# Altium schematic sheet MarsCarrier.SchDoc: My title
size A3; Organization: University of California; Address1: 475 Portola Plaza; Address2: Los Angeles, CA 90095; DocumentNumber: 19; Revision: R01; SheetNumber: 19; SheetTotal: 35
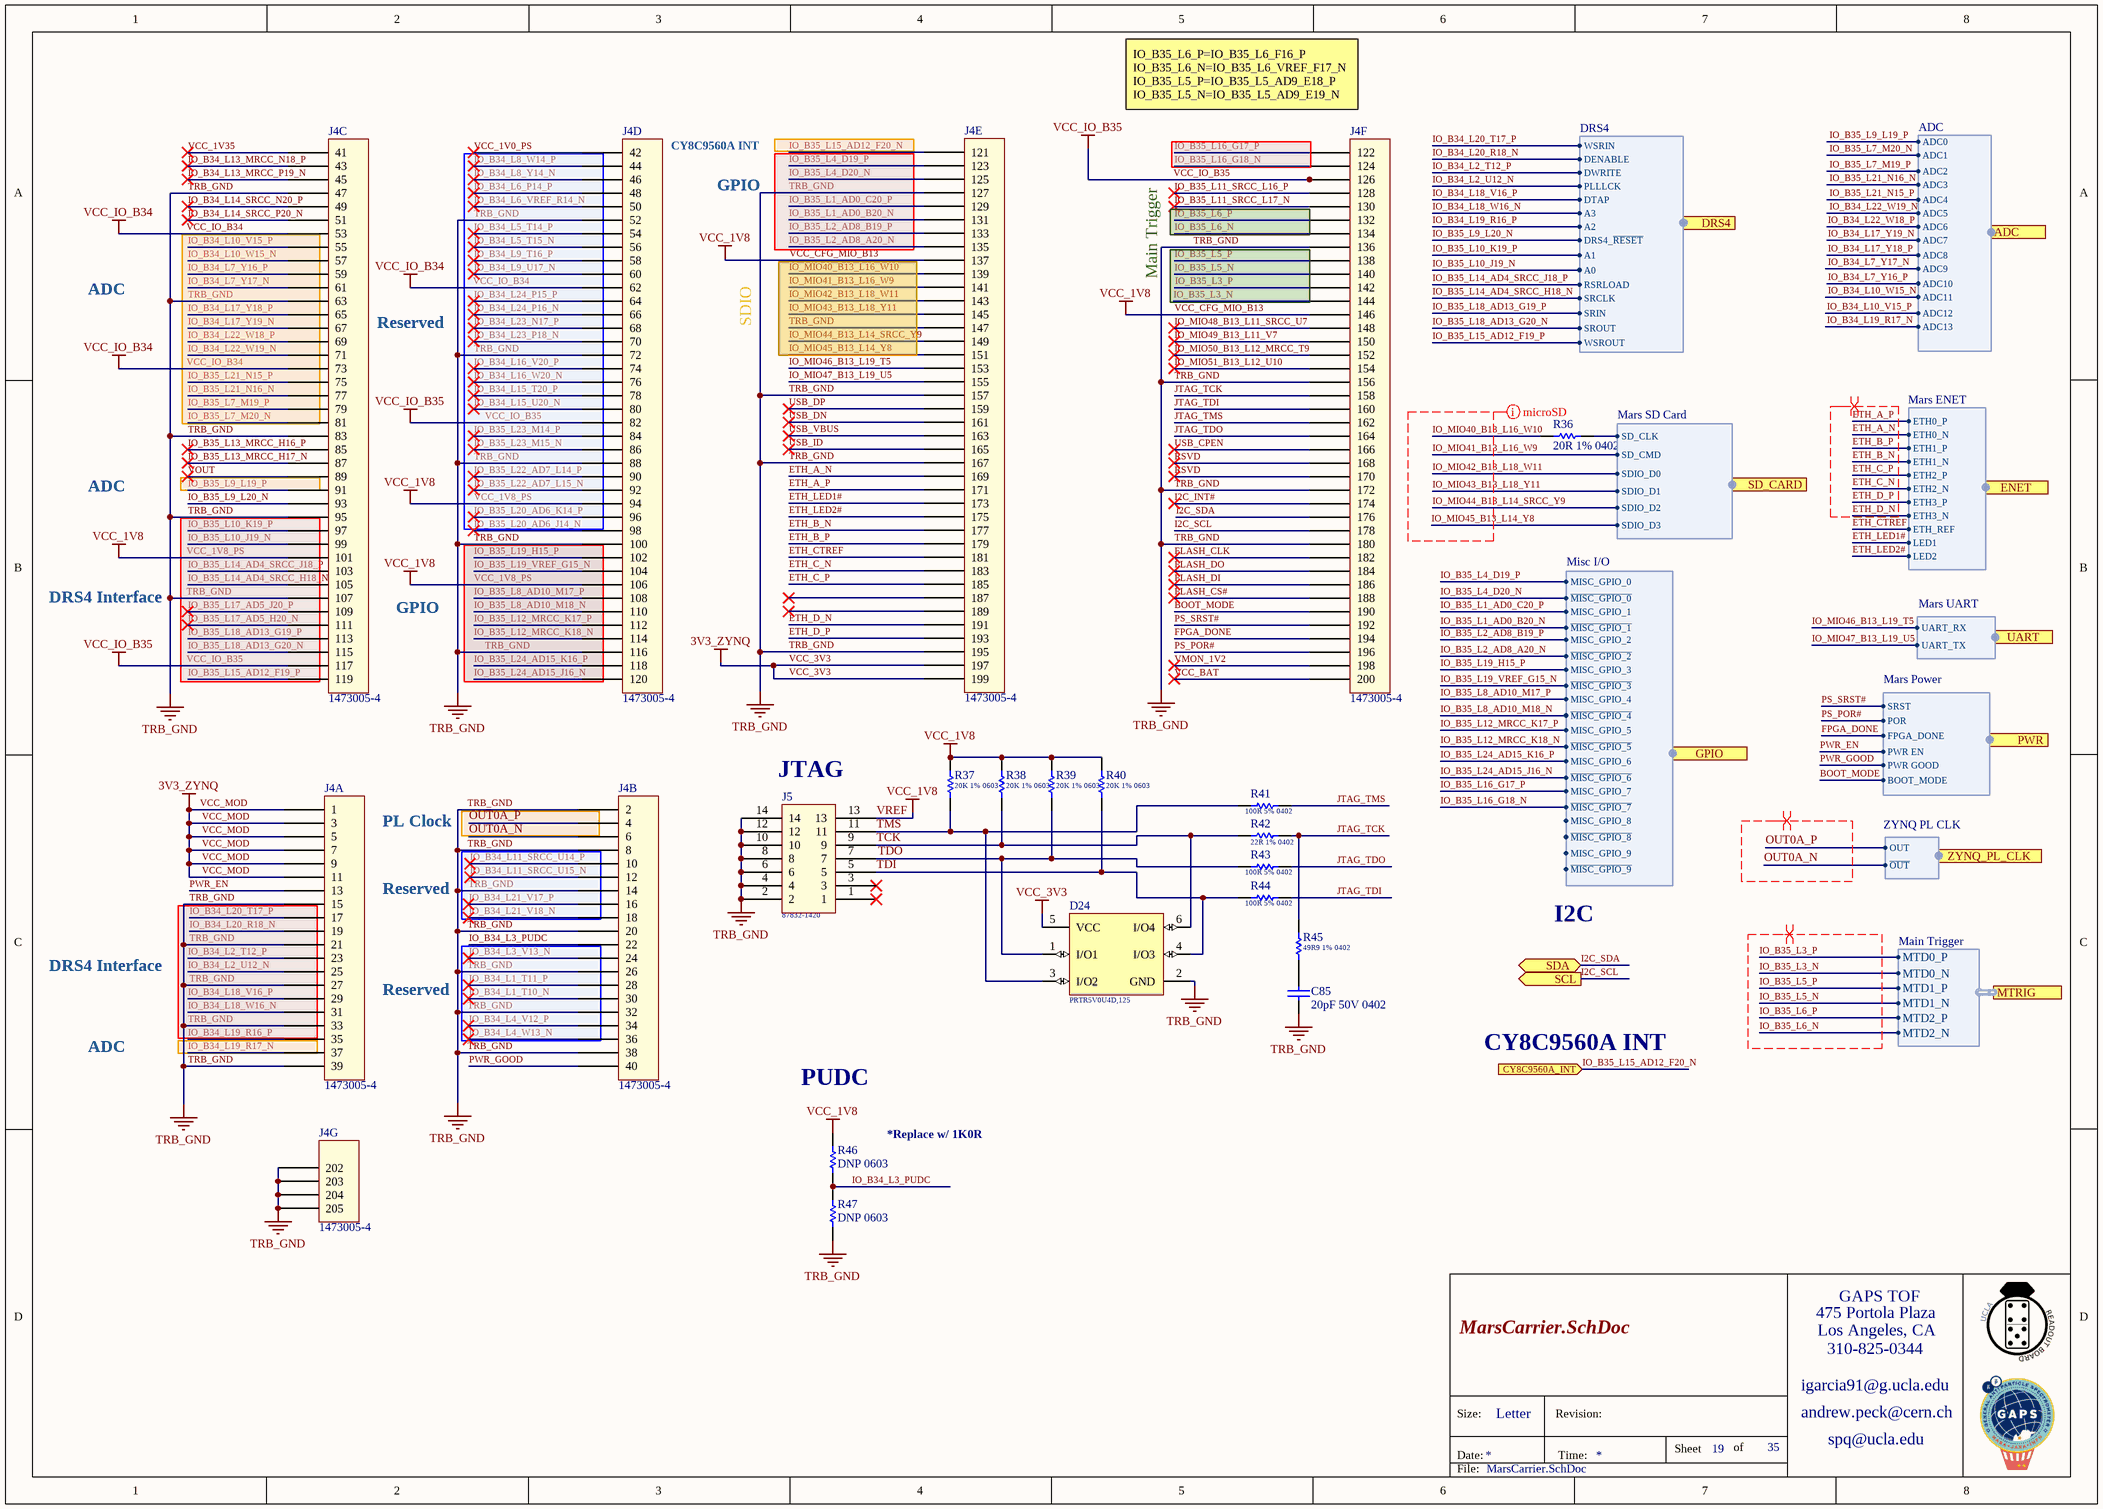
[diagram p0: MarsCarrier.SchDoc]

## Parts
C85  Capacitance: 20pF 50V 0402  [Cap_Murata_GJM1555C1H200GB01D_20pF]  (hidden comment: Cap_Murata_GJM1555C1H200GB01D_20pF)
D24  PRTR5V0U4D,125  [PRTR5V0U4D,125]
J4  Series: 1473005-4  [DIMM_TE_Connectivity_1473005-4_200POS]  (hidden comment: DIMM_TE_Connectivity_1473005-4_200POS)  (parts A,B,C,D,E,F,G of 7)
J5  Series: 87832-1420  [Header_Molex_87832-1420_14POS]  (hidden comment: Header_Molex_87832-1420_14POS)
R36  Resistance: 20R 1% 0402  [Res_ROHM_SFR01MZPF20R0_20_Ohm]  (hidden comment: Res_ROHM_SFR01MZPF20R0_20_Ohm)
R37  20K 1% 0603  [RESC0603(1608)_L]
R38  20K 1% 0603  [RESC0603(1608)_L]
R39  20K 1% 0603  [RESC0603(1608)_L]
R40  20K 1% 0603  [RESC0603(1608)_L]
R41  100R 5% 0402  [RESC0402(1005)_L]
R42  22R 1% 0402  [RESC0402(1005)_L]
R43  100R 5% 0402  [RESC0402(1005)_L]
R44  100R 5% 0402  [RESC0402(1005)_L]
R45  49R9 1% 0402  [RESC0402(1005)_L]
R46  Resistance: DNP 0603  [RES_DNP_0603]  (hidden comment: RES_DNP_0603)
R47  Resistance: DNP 0603  [RES_DNP_0603]  (hidden comment: RES_DNP_0603)

## Ports
ADC (harness ADC), CY8C9560A_INT (in), DRS4 (harness DRS4), ENET (harness Mars ENET), GPIO (harness Misc I/O), MTRIG (harness Main Trigger), PWR (harness Mars Power), SCL (out), SD_CARD (harness Mars SD Card), SDA (bidir), UART (harness Mars UART), ZYNQ_PL_CLK (harness ZYNQ PL CLK)

## Harnesses
Mars SD Card: SDIO_D2, SDIO_D1, SDIO_D0, SD_CMD, SD_CLK, SDIO_D3
Mars UART: UART_RX, UART_TX
ADC: ADC0, ADC1, ADC2, ADC3, ADC4, ADC5, ADC6, ADC7, ADC8, ADC9, ADC10, ADC11, ADC12, ADC13
Mars ENET: ETH0_P, ETH0_N, ETH1_P, ETH1_N, ETH2_P, ETH2_N, ETH3_P, ETH3_N, ETH_REF, LED1, LED2
Mars Power: PWR GOOD, PWR EN, FPGA_DONE, SRST, POR, BOOT_MODE
ZYNQ PL CLK: OUT, ~{OUT}
Misc I/O: MISC_GPIO_0, ~{MISC_GPIO_0}, MISC_GPIO_1, ~{MISC_GPIO_1}, MISC_GPIO_2, ~{MISC_GPIO_2}, MISC_GPIO_3, ~{MISC_GPIO_3}, MISC_GPIO_4, ~{MISC_GPIO_4}, MISC_GPIO_5, ~{MISC_GPIO_5}, MISC_GPIO_6, ~{MISC_GPIO_6}, MISC_GPIO_7, ~{MISC_GPIO_7}, MISC_GPIO_8, ~{MISC_GPIO_8}, MISC_GPIO_9, ~{MISC_GPIO_9}
DRS4: A3, A2, A1, A0, DTAP, SROUT, SRCLK, SRIN, RSRLOAD, WSROUT, DWRITE, PLLLCK, WSRIN, DENABLE, DRS4_~{RESET}
Main Trigger: MTD0_P, MTD0_N, MTD1_P, MTD1_N, MTD2_P, MTD2_N

## Nets
TRB_GND: C85.1 D24.2(GND) J4.2 J4.8 J4.14 J4.15 J4.20 J4.21 J4.26 J4.27 J4.32 J4.33 J4.38 J4.39 J4.47 J4.52 J4.63 J4.72 J4.83 J4.88 J4.95 J4.100 J4.107 J4.116 J4.127 J4.136 J4.147 J4.156 J4.157 J4.167 J4.172 J4.180 J4.195 J4.202 J4.203 J4.204 J4.205 J5.2 J5.4 J5.6 J5.8 J5.10 J5.12 J5.14 R47.2
VCC_1V8_PS: J4.94 J4.101 J4.106 J4.137 J4.146 J5.13 R37.2 R38.2 R39.2 R40.2 R46.1  [also labelled VCC_1V8, VCC_CFG_MIO_B13, VREF]
VCC_3V3: D24.5(VCC) J4.1 J4.3 J4.5 J4.7 J4.9 J4.11 J4.197 J4.199  [also labelled 3V3_ZYNQ, VCC_MOD]
VCC_IO_B34: J4.53 J4.62 J4.73
VCC_IO_B35: J4.82 J4.117 J4.126
BOOT_MODE: J4.190 ; port PWR.BOOT_MODE
ETH_A_N: J4.169 ; port ENET.ETH0_N
ETH_A_P: J4.171 ; port ENET.ETH0_P
ETH_B_N: J4.177 ; port ENET.ETH1_N
ETH_B_P: J4.179 ; port ENET.ETH1_P
ETH_C_N: J4.183 ; port ENET.ETH2_N
ETH_C_P: J4.185 ; port ENET.ETH2_P
ETH_CTREF: J4.181 ; port ENET.ETH_REF
ETH_D_N: J4.191 ; port ENET.ETH3_N
ETH_D_P: J4.193 ; port ENET.ETH3_P
ETH_LED1#: J4.173 ; port ENET.LED1
ETH_LED2#: J4.175 ; port ENET.LED2
FLASH_CLK: J4.182
FLASH_CS#: J4.188
FLASH_DI: J4.186
FLASH_DO: J4.184
FPGA_DONE: J4.194 ; port PWR.FPGA_DONE
I2C_INT#: J4.174
I2C_SCL: J4.178 ; port SCL
I2C_SDA: J4.176 ; port SDA
IO_B34_L1_T10_N: J4.30
IO_B34_L1_T11_P: J4.28
IO_B34_L2_T12_P: J4.23 ; port DRS4.DWRITE
IO_B34_L2_U12_N: J4.25 ; port DRS4.PLLLCK
IO_B34_L3_PUDC: J4.22 R46.2 R47.1
IO_B34_L3_V13_N: J4.24
IO_B34_L4_V12_P: J4.34
IO_B34_L4_W13_N: J4.36
IO_B34_L5_T14_P: J4.54
IO_B34_L5_T15_N: J4.56
IO_B34_L6_P14_P: J4.48
IO_B34_L6_VREF_R14_N: J4.50
IO_B34_L7_Y16_P: J4.59 ; port ADC.ADC10
IO_B34_L7_Y17_N: J4.61 ; port ADC.ADC9
IO_B34_L8_W14_P: J4.44
IO_B34_L8_Y14_N: J4.46
IO_B34_L9_T16_P: J4.58
IO_B34_L9_U17_N: J4.60
IO_B34_L10_V15_P: J4.55 ; port ADC.ADC12
IO_B34_L10_W15_N: J4.57 ; port ADC.ADC11
IO_B34_L11_SRCC_U14_P: J4.10
IO_B34_L11_SRCC_U15_N: J4.12
IO_B34_L13_MRCC_N18_P: J4.43
IO_B34_L13_MRCC_P19_N: J4.45
IO_B34_L14_SRCC_N20_P: J4.49
IO_B34_L14_SRCC_P20_N: J4.51
IO_B34_L15_T20_P: J4.78
IO_B34_L15_U20_N: J4.80
IO_B34_L16_V20_P: J4.74
IO_B34_L16_W20_N: J4.76
IO_B34_L17_Y18_P: J4.65 ; port ADC.ADC8
IO_B34_L17_Y19_N: J4.67 ; port ADC.ADC7
IO_B34_L18_V16_P: J4.29 ; port DRS4.DTAP
IO_B34_L18_W16_N: J4.31 ; port DRS4.A3
IO_B34_L19_R16_P: J4.35 ; port DRS4.A2
IO_B34_L19_R17_N: J4.37 ; port ADC.ADC13
IO_B34_L20_R18_N: J4.19 ; port DRS4.DENABLE
IO_B34_L20_T17_P: J4.17 ; port DRS4.WSRIN
IO_B34_L21_V17_P: J4.16
IO_B34_L21_V18_N: J4.18
IO_B34_L22_W18_P: J4.69 ; port ADC.ADC6
IO_B34_L22_W19_N: J4.71 ; port ADC.ADC5
IO_B34_L23_N17_P: J4.68
IO_B34_L23_P18_N: J4.70
IO_B34_L24_P15_P: J4.64
IO_B34_L24_P16_N: J4.66
IO_B35_L1_AD0_B20_N: J4.131 ; port GPIO.~{MISC_GPIO_1}
IO_B35_L1_AD0_C20_P: J4.129 ; port GPIO.MISC_GPIO_1
IO_B35_L2_AD8_A20_N: J4.135 ; port GPIO.~{MISC_GPIO_2}
IO_B35_L2_AD8_B19_P: J4.133 ; port GPIO.MISC_GPIO_2
IO_B35_L3_N: J4.144 ; port MTRIG.MTD0_N
IO_B35_L3_P: J4.142 ; port MTRIG.MTD0_P
IO_B35_L4_D19_P: J4.123 ; port GPIO.MISC_GPIO_0
IO_B35_L4_D20_N: J4.125 ; port GPIO.~{MISC_GPIO_0}
IO_B35_L5_N: J4.140 ; port MTRIG.MTD1_N
IO_B35_L5_P: J4.138 ; port MTRIG.MTD1_P
IO_B35_L6_N: J4.134 ; port MTRIG.MTD2_N
IO_B35_L6_P: J4.132 ; port MTRIG.MTD2_P
IO_B35_L7_M19_P: J4.79 ; port ADC.ADC2
IO_B35_L7_M20_N: J4.81 ; port ADC.ADC1
IO_B35_L8_AD10_M17_P: J4.108 ; port GPIO.MISC_GPIO_4
IO_B35_L8_AD10_M18_N: J4.110 ; port GPIO.~{MISC_GPIO_4}
IO_B35_L9_L19_P: J4.91 ; port ADC.ADC0
IO_B35_L9_L20_N: J4.93 ; port DRS4.DRS4_~{RESET}
IO_B35_L10_J19_N: J4.99 ; port DRS4.A0
IO_B35_L10_K19_P: J4.97 ; port DRS4.A1
IO_B35_L11_SRCC_L16_P: J4.128
IO_B35_L11_SRCC_L17_N: J4.130
IO_B35_L12_MRCC_K17_P: J4.112 ; port GPIO.MISC_GPIO_5
IO_B35_L12_MRCC_K18_N: J4.114 ; port GPIO.~{MISC_GPIO_5}
IO_B35_L13_MRCC_H16_P: J4.85
IO_B35_L13_MRCC_H17_N: J4.87
IO_B35_L14_AD4_SRCC_H18_N: J4.105 ; port DRS4.SRCLK
IO_B35_L14_AD4_SRCC_J18_P: J4.103 ; port DRS4.RSRLOAD
IO_B35_L15_AD12_F19_P: J4.119 ; port DRS4.WSROUT
IO_B35_L15_AD12_F20_N: J4.121 ; port CY8C9560A_INT
IO_B35_L16_G17_P: J4.122 ; port GPIO.MISC_GPIO_7
IO_B35_L16_G18_N: J4.124 ; port GPIO.~{MISC_GPIO_7}
IO_B35_L17_AD5_H20_N: J4.111
IO_B35_L17_AD5_J20_P: J4.109
IO_B35_L18_AD13_G19_P: J4.113 ; port DRS4.SRIN
IO_B35_L18_AD13_G20_N: J4.115 ; port DRS4.SROUT
IO_B35_L19_H15_P: J4.102 ; port GPIO.MISC_GPIO_3
IO_B35_L19_VREF_G15_N: J4.104 ; port GPIO.~{MISC_GPIO_3}
IO_B35_L20_AD6_J14_N: J4.98
IO_B35_L20_AD6_K14_P: J4.96
IO_B35_L21_N15_P: J4.75 ; port ADC.ADC4
IO_B35_L21_N16_N: J4.77 ; port ADC.ADC3
IO_B35_L22_AD7_L14_P: J4.90
IO_B35_L22_AD7_L15_N: J4.92
IO_B35_L23_M14_P: J4.84
IO_B35_L23_M15_N: J4.86
IO_B35_L24_AD15_J16_N: J4.120 ; port GPIO.~{MISC_GPIO_6}
IO_B35_L24_AD15_K16_P: J4.118 ; port GPIO.MISC_GPIO_6
IO_MIO40_B13_L16_W10: J4.139 R36.1
IO_MIO41_B13_L16_W9: J4.141 ; port SD_CARD.SD_CMD
IO_MIO42_B13_L18_W11: J4.143 ; port SD_CARD.SDIO_D0
IO_MIO43_B13_L18_Y11: J4.145 ; port SD_CARD.SDIO_D1
IO_MIO44_B13_L14_SRCC_Y9: J4.149 ; port SD_CARD.SDIO_D2
IO_MIO45_B13_L14_Y8: J4.151 ; port SD_CARD.SDIO_D3
IO_MIO46_B13_L19_T5: J4.153 ; port UART.UART_RX
IO_MIO47_B13_L19_U5: J4.155 ; port UART.UART_TX
IO_MIO48_B13_L11_SRCC_U7: J4.148
IO_MIO49_B13_L11_V7: J4.150
IO_MIO50_B13_L12_MRCC_T9: J4.152
IO_MIO51_B13_L12_U10: J4.154
JTAG_TCK: J4.158 R42.1 R45.1
JTAG_TDI: J4.160 R44.1
JTAG_TDO: J4.164 R43.1
JTAG_TMS: J4.162 R41.1
OUT0A_N: J4.6 ; port ZYNQ_PL_CLK.~{OUT}
OUT0A_P: J4.4 ; port ZYNQ_PL_CLK.OUT
PS_POR#: J4.196 ; port PWR.POR
PS_SRST#: J4.192 ; port PWR.SRST
PWR_EN: J4.13 ; port PWR.PWR EN
PWR_GOOD: J4.40 ; port PWR.PWR GOOD
RSVD: J4.168 J4.170
TCK: D24.6(I/O4) J5.9 R38.1 R42.2
TDI: D24.4(I/O3) J5.5 R40.1 R44.2
TDO: D24.1(I/O1) J5.7 R39.1 R43.2
TMS: D24.3(I/O2) J5.11 R37.1 R41.2
USB_CPEN: J4.166
USB_DN: J4.161
USB_DP: J4.159
USB_ID: J4.165
USB_VBUS: J4.163
VCC_1V0_PS: J4.42
VCC_1V35: J4.41
VCC_BAT: J4.200
VMON_1V2: J4.198
VOUT: J4.89
NetC85_2: C85.2 R45.2
NetR36_2: R36.2 ; port SD_CARD.SD_CLK

Not connected (* = marked no-connect by the designer): J4 187* 189*; J5 1* 3*

## Layout directives
net class S50; rule Matched Net Lengths [Tolerance = 100mil]: IO_MIO40_B13_L16_W10, IO_MIO41_B13_L16_W9, IO_MIO42_B13_L18_W11, IO_MIO43_B13_L18_Y11, IO_MIO44_B13_L14_SRCC_Y9, IO_MIO45_B13_L14_Y8
differential pair; rule Differential Pairs Routing [Pref Gap = 10mil    Min Gap  = 5mil    Max Gap  = 10milPref Width = 15mil    Min Width  = 3.244mil    Max Width  = 15mil]; differential pair class D100; rule Matched Net Lengths [Tolerance = 100mil]: IO_B35_L3_N, IO_B35_L3_P, IO_B35_L5_N, IO_B35_L5_P, IO_B35_L6_N, IO_B35_L6_P
differential pair; differential pair class D100: OUT0A_N, OUT0A_P
differential pair; differential pair class D100; rule Differential Pairs Routing [Pref Gap = 10mil    Min Gap  = 5mil    Max Gap  = 10milPref Width = 15mil    Min Width  = 3.244mil    Max Width  = 15mil]: ETH_A_N, ETH_A_P, ETH_B_N, ETH_B_P, ETH_C_N, ETH_C_P, ETH_D_N, ETH_D_P

## Notes on the sheet
- (near J4) IO_B35_L6_P=IO_B35_L6_F16_P IO_B35_L6_N=IO_B35_L6_VREF_F17_N IO_B35_L5_P=IO_B35_L5_AD9_E18_P IO_B35_L5_N=IO_B35_L5_AD9_E19_N
- (near J4) CY8C9560A INT
- GPIO
- ADC
- Main Trigger
- (near J4) Reserved
- SDIO
- DRS4 Interface
- (near J5) JTAG
- PL Clock
- Reserved
- I2C
- CY8C9560A INT
- PUDC
- *Replace w/ 1K0R
- 475 Portola Plaza
- GAPS TOF
- igarcia91@g.ucla.edu
- Los Angeles, CA
- 310-825-0344
- Size:
- Date:
- Letter
- Revision:
- Time:
- Sheet
- of
- andrew.peck@cern.ch
- spq@ucla.edu
- File:

## Library data of the parts
C85 = Cap_Murata_GJM1555C1H200GB01D_20pF: Multilayer Ceramic Capacitors MLCC - SMD/SMT 0402 20pF 50Volts C0G 2%; Supplier 1: Mouser; Supplier Part Number 1: 81-GJM1555C1H200GB01
D24 = PRTR5V0U4D,125: ESD Suppressors / TVS Diodes 5.5V QUAD R-R ESD ULTRA LOW CAP; Supplier 1: Mouser; Supplier Part Number 1: 771-PRTR5V0U4D-T/R
J4 = DIMM_TE_Connectivity_1473005-4_200POS: DIMM Connectors DDR2 SODIMM 200P STANDARD HOUSING; Supplier 1: Mouser; Supplier Part Number 1: 571-1473005-4
J5 = Header_Molex_87832-1420_14POS: Headers & Wire Housings 14P SMD PB FREE SHRD; Supplier Part Number 1: 538-87832-1420; Supplier 1: Mouser
R36 = Res_ROHM_SFR01MZPF20R0_20_Ohm: 20R 62.5mW 1% 0402 (1005 Metric)  SMD; Supplier 1: Mouser; Supplier Part Number 1: 755-SFR01MZPF20R0
R37-R40 = CMP-1012-00655-1: 20K 0.1W 1% 0603 (1608 Metric)  SMD; Case-Metric: 1608; Case-EIA: 0603; Value: 20000.00 Ohm; Technology: SMT; Tolerance: 1 %; Power: 0.1 W
R41 R43 R44 = CMP-1011-00050-1: 100R 0.063W 5% 0402 (1005 Metric)  SMD; Case-EIA: 0402; Value: 100.00 Ohm; Case-Metric: 1005; Tolerance: 5 %; Technology: SMT; Power: 0.063 W
R42 = CMP-1011-00320-1: 22R 0.063W 1% 0402 (1005 Metric)  SMD; Case-EIA: 0402; Case-Metric: 1005; Value: 22.00 Ohm; Tolerance: 1 %; Technology: SMT; Power: 0.063 W
R45 = CMP-1011-00363-1: 49R9 0.063W 1% 0402 (1005 Metric)  SMD; Case-EIA: 0402; Case-Metric: 1005; Value: 49.90 Ohm; Power: 0.063 W; Technology: SMT; Tolerance: 1 %
R46 R47 = RES_DNP_0603: 0603 Do not place resistor